# EAGLE schematic Main&MotorBoard v15 (EAGLE 9.7.0)
Assembly variants: supply, A

## Sheet 1 of 7: Cover
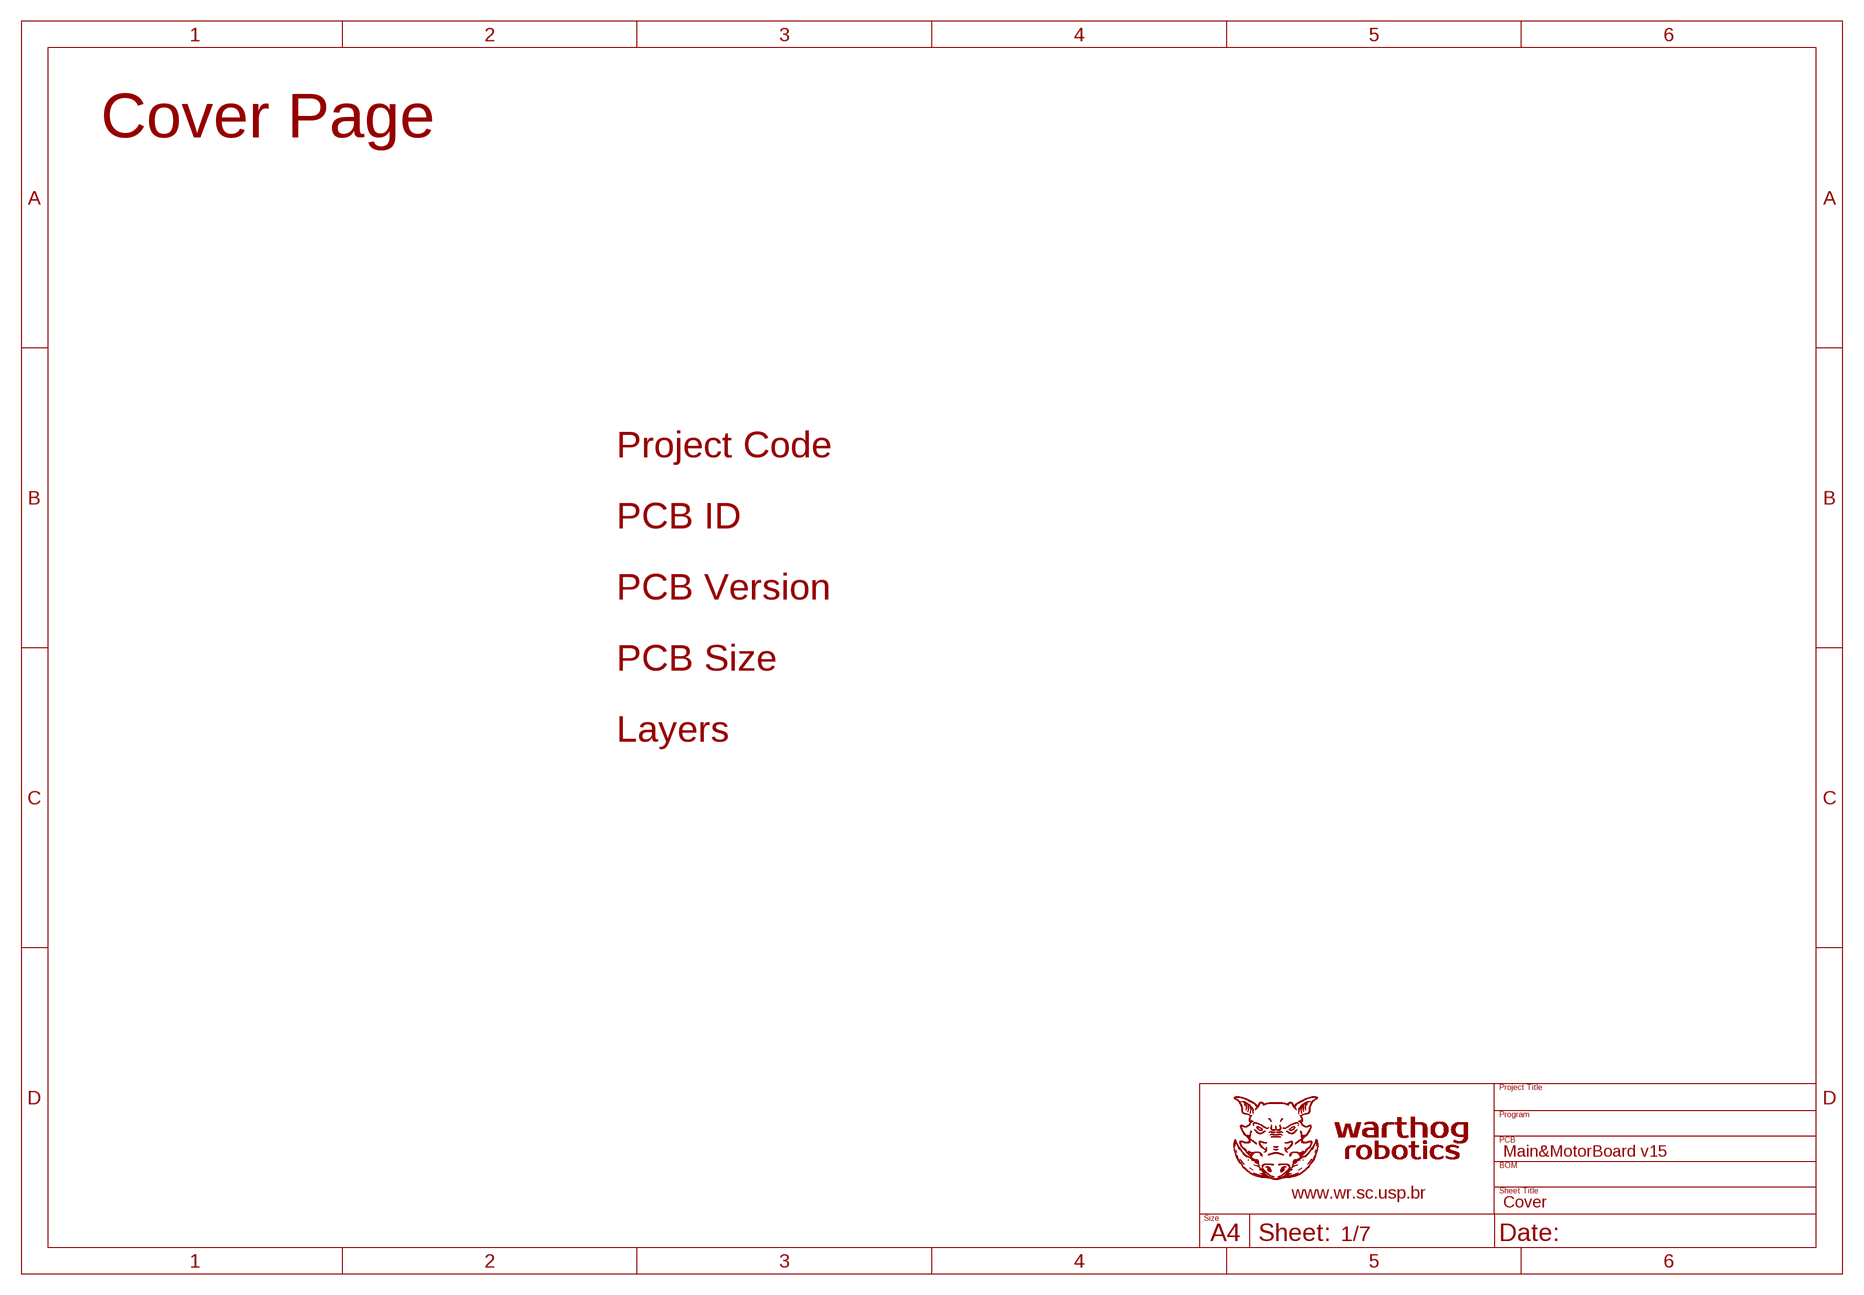
[diagram p0: schematic, sheet 1]

## Sheet 2 of 7: SUPPLY
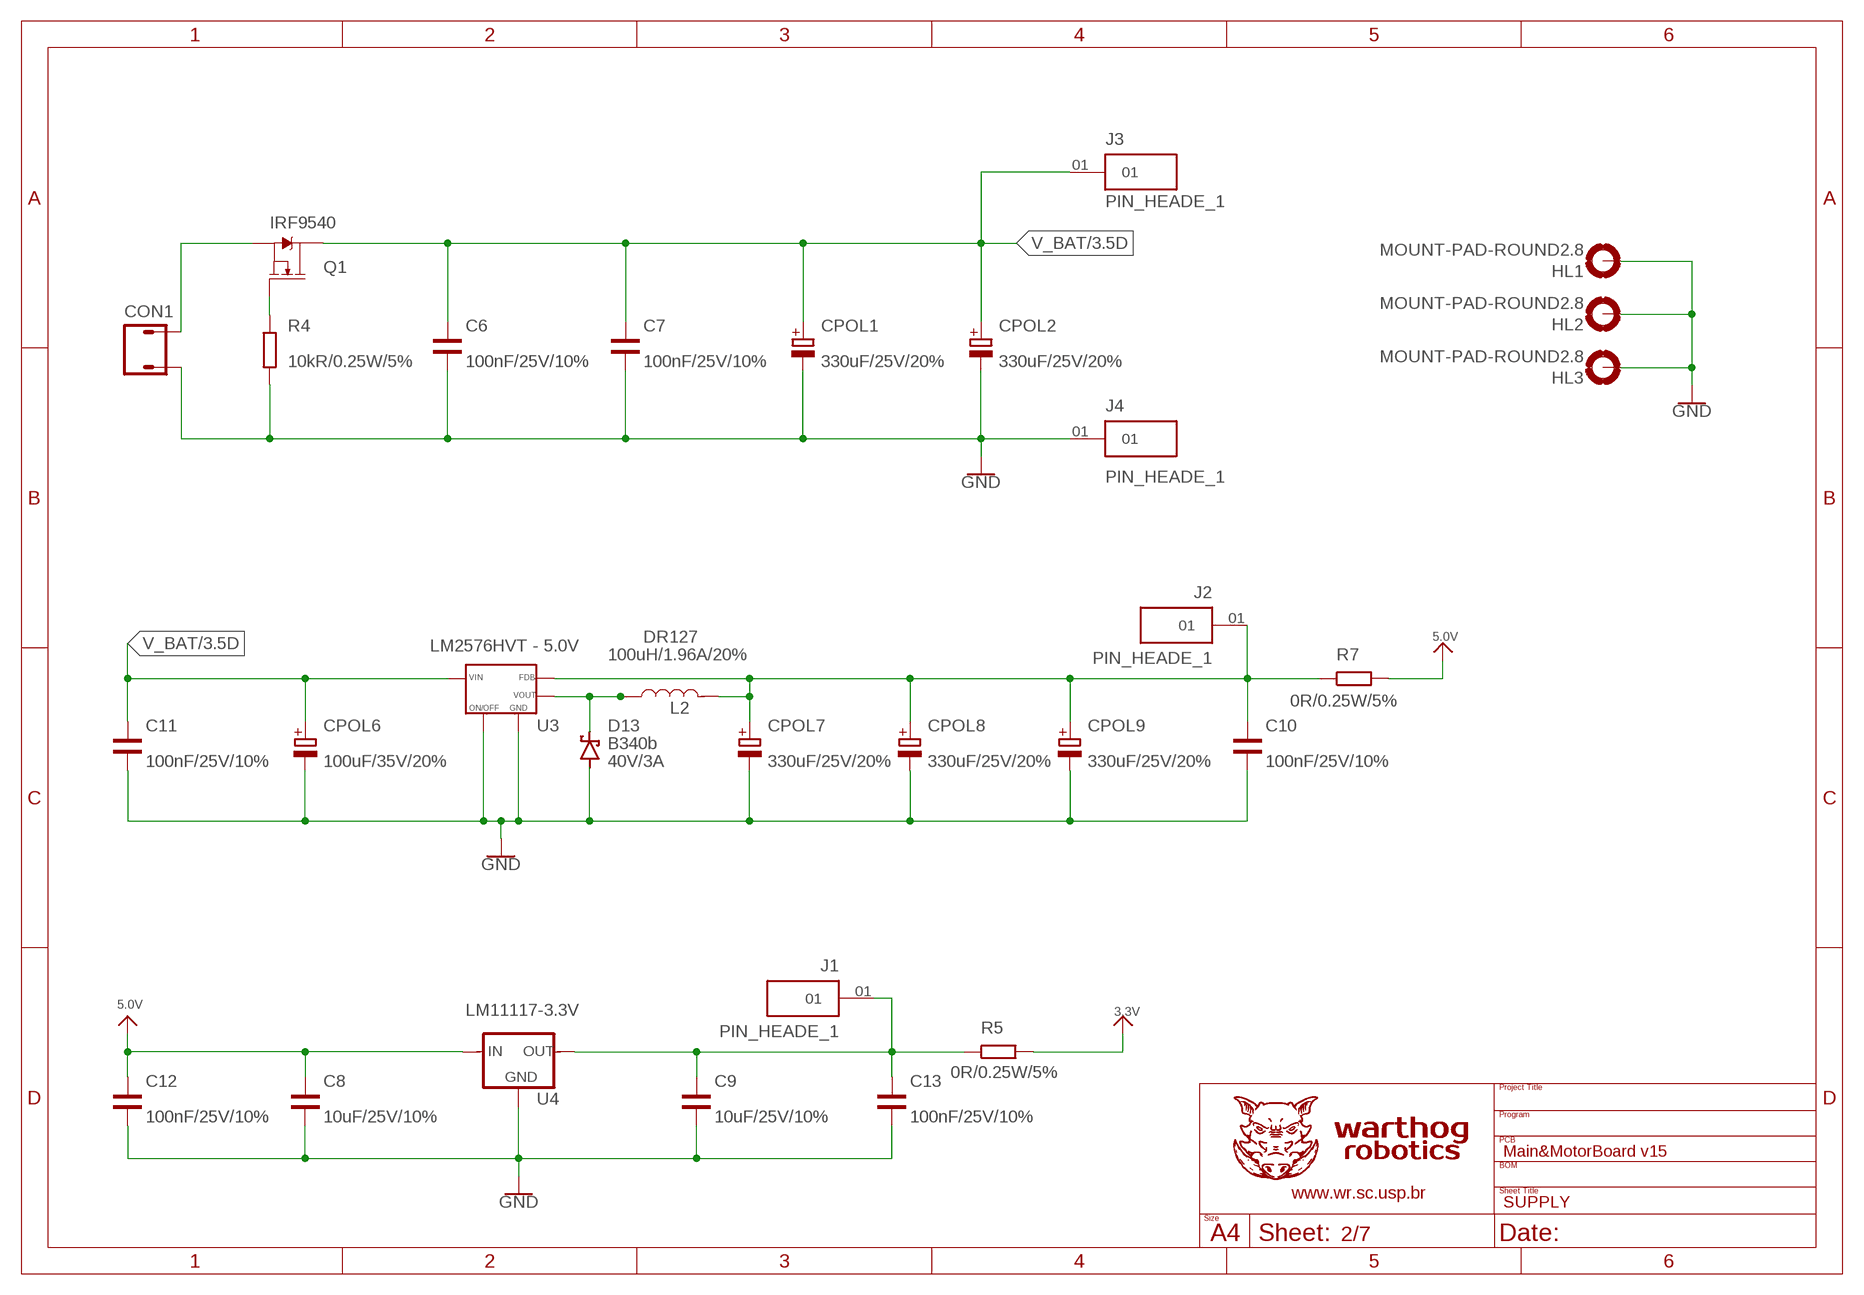
[diagram p1: schematic, sheet 2]

### Parts
C6  100nF/25V/10%  C0805(M)  [C0805(M)]
C7  100nF/25V/10%  C0805(M)  [C0805(M)]
C8  10uF/25V/10%  C0805(M)  [C0805(M)]
C9  10uF/25V/10%  C0805(M)  [C0805(M)]
C10  100nF/25V/10%  C0805(M)  [C0805(M)]
C11  100nF/25V/10%  C0805(M)  [C0805(M)]
C12  100nF/25V/10%  C0805(M)  [C0805(M)]
C13  100nF/25V/10%  C0805(M)  [C0805(M)]
CON1  MICROFIT_HEADER-2X01-90°-BACKUP  [2X01-3.00MM-90°]
CPOL1  330uF/25V/20%  CPOLE5-10.5  [E5-10,5]
CPOL2  330uF/25V/20%  CPOLE5-10.5  [E5-10,5]
CPOL6  100uF/35V/20%  CPOLE5-10.5  [E5-10,5]
CPOL7  330uF/25V/20%  CPOLE5-10.5  [E5-10,5]
CPOL8  330uF/25V/20%  CPOLE5-10.5  [E5-10,5]
CPOL9  330uF/25V/20%  CPOLE5-10.5  [E5-10,5]
D13  40V/3A  DIODE_SCHOTTIK  [SMC]
HL1  MOUNT-PAD-ROUND2.8  [2,8-PAD]
HL2  MOUNT-PAD-ROUND2.8  [2,8-PAD]
HL3  MOUNT-PAD-ROUND2.8  [2,8-PAD]
J1  PIN_HEADE_1  [SAMTEC_MTMM-101-X-X-S-X]
J2  PIN_HEADE_1  [SAMTEC_MTMM-101-X-X-S-X]
J3  PIN_HEADE_1  [SAMTEC_MTMM-101-X-X-S-X]
J4  PIN_HEADE_1  [SAMTEC_MTMM-101-X-X-S-X]
L2  100uH/1.96A/20%  INDUCTOR  [DR127]
Q1  IRF9540  [TO254P1052X465X1989-3]
R4  10kR/0.25W/5%  R0805(M)  [C0805(M)]  (not fitted in variant supply)
R5  0R/0.25W/5%  R0805(M)  [C0805(M)]
R7  0R/0.25W/5%  R0805(M)  [C0805(M)]
U3  LM2576HVT - 5.0V  LM2576  [TO263-5]
U4  LM11117-3.3V  REG1117  [SOT230P700X170-4]

### Nets
3.3V [Power]: R5.2 ; also sheet 4,5,6,7
5.0V [Power]: C8.1 C12.1 R7.2 U4.3(IN) ; also sheet 3,4
FDB: C10.1 CPOL7.+ CPOL8.+ CPOL9.+ J2.01 L2.1 R7.1 U3.FDB(FEEDBACK)
GND [Power]: C6.2 C7.2 C8.2 C9.2 C10.2 C11.2 C12.2 C13.2 CON1.2 CPOL1.- CPOL2.- CPOL6.- CPOL7.- CPOL8.- CPOL9.- D13.A HL1.B2,8(MOUNT) HL2.B2,8(MOUNT) HL3.B2,8(MOUNT) J4.01 R4.2 U3.GND U3.ON/OFF(ON\OFF) U3.TAB(GND) U4.1(GND) ; also sheet 3,4,5,6,7
N$5: CON1.1 Q1.S
N$7: Q1.G R4.1
N$11 [Power]: D13.C L2.2 U3.OUT
OUT_3.3: C9.1 C13.1 J1.01 R5.1 U4.2(OUT) U4.4(OUT)
V_BAT: C6.1 C7.1 C11.1 CPOL1.+ CPOL2.+ CPOL6.+ J3.01 Q1.D U3.VIN ; also sheet 3,4

### Notes on the sheet
- DR127
- B340b

## Sheet 3 of 7: MOTOR DRIVE
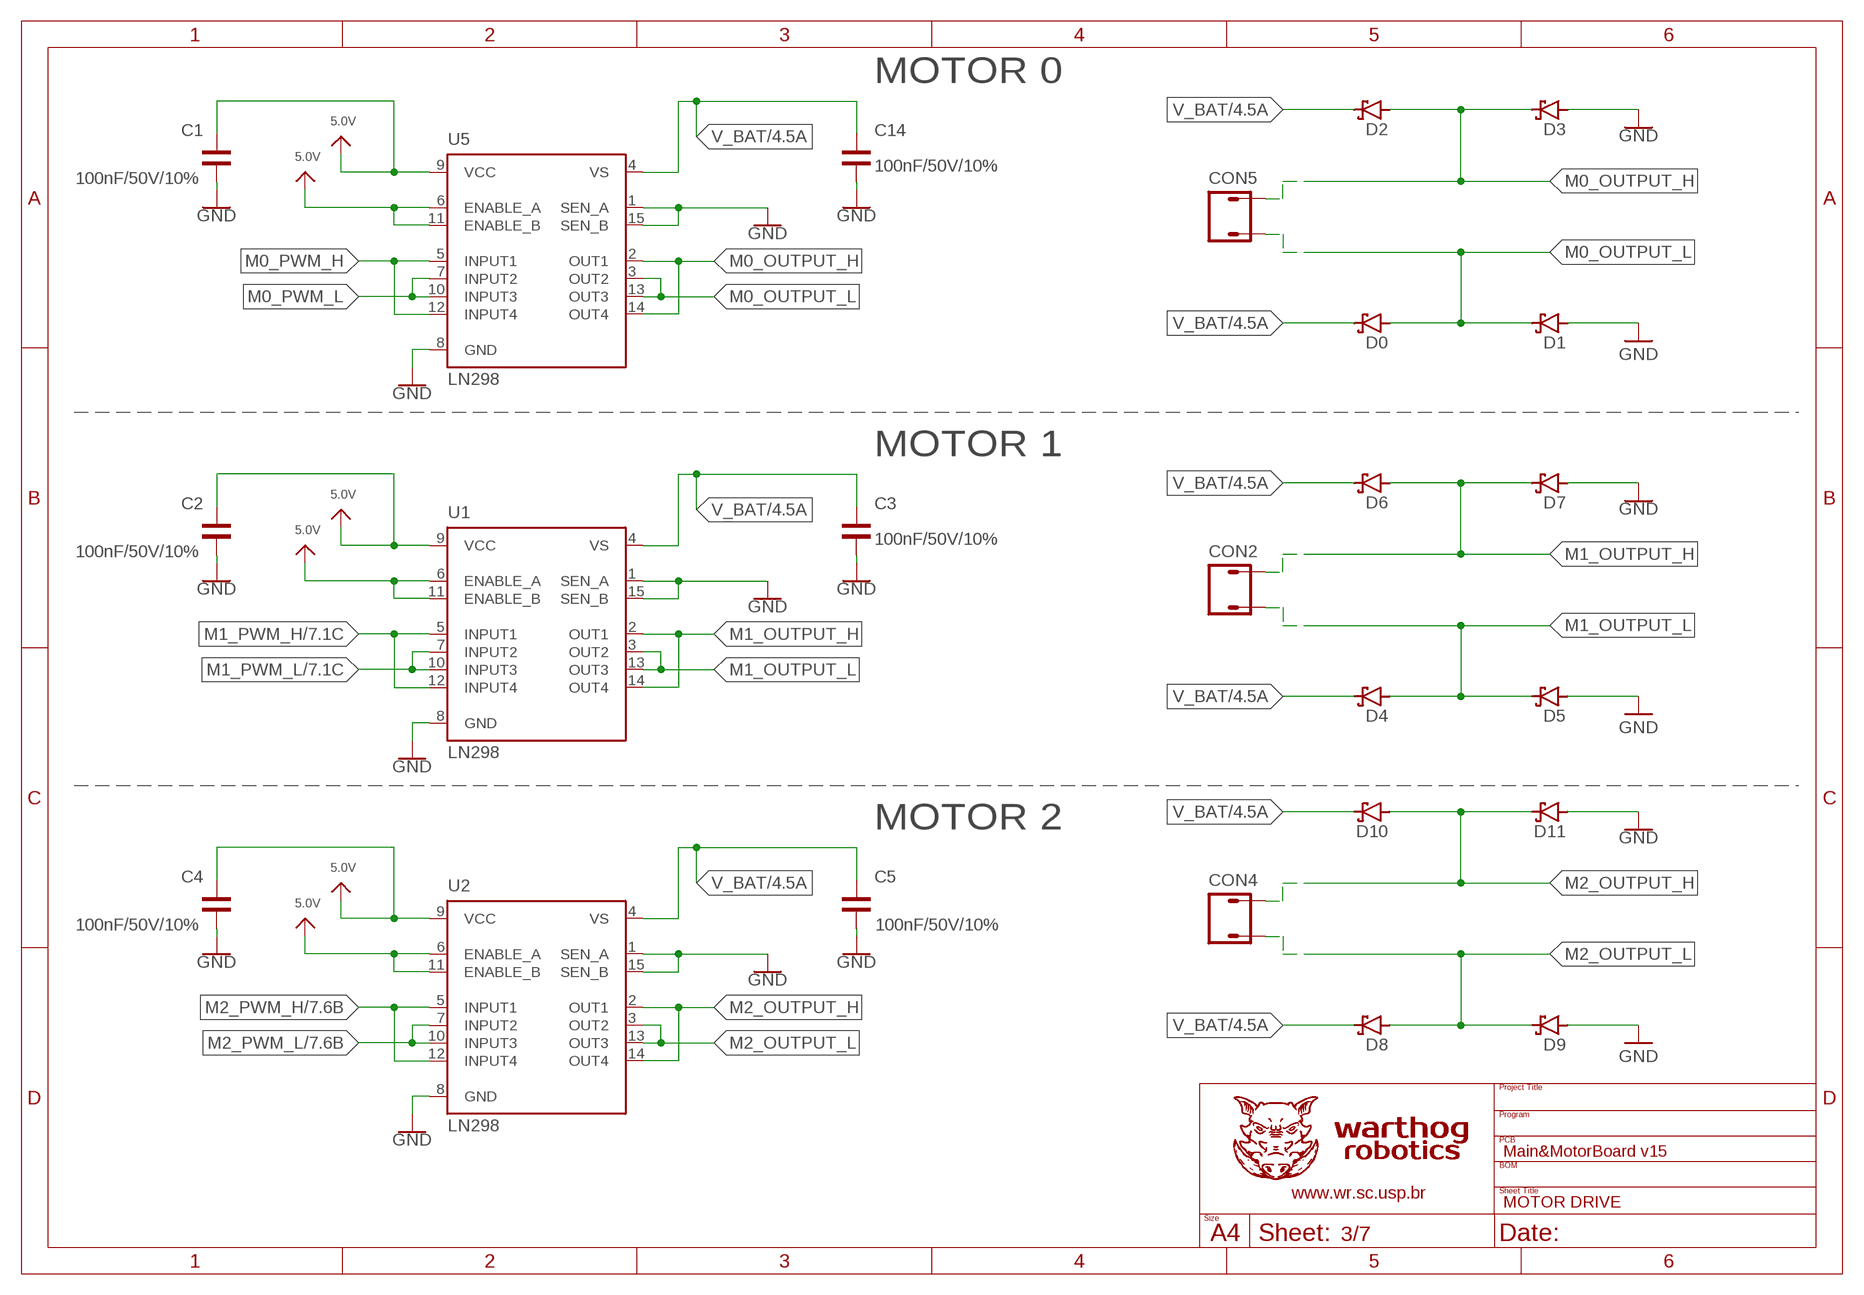
[diagram p2: schematic, sheet 3]

### Parts
C1  100nF/50V/10%  C0805(N)  [C0805(N)]
C2  100nF/50V/10%  C0805(N)  [C0805(N)]
C3  100nF/50V/10%  C0805(N)  [C0805(N)]
C4  100nF/50V/10%  C0805(N)  [C0805(N)]
C5  100nF/50V/10%  C0805(N)  [C0805(N)]
C14  100nF/50V/10%  C0805(N)  [C0805(N)]
CON2  MICROFIT_HEADER-2X01-90°-BACKUP  [2X01-3.00MM-90°]
CON4  MICROFIT_HEADER-2X01-90°-BACKUP  [2X01-3.00MM-90°]
CON5  MICROFIT_HEADER-2X01-90°-BACKUP  [2X01-3.00MM-90°]
D0  1N5406  [DO201-15(N)]
D1  1N5406  [DO201-15(N)]
D2  1N5406  [DO201-15(N)]
D3  1N5406  [DO201-15(N)]
D4  1N5406  [DO201-15(N)]
D5  1N5406  [DO201-15(N)]
D6  1N5406  [DO201-15(N)]
D7  1N5406  [DO201-15(N)]
D8  1N5406  [DO201-15(N)]
D9  1N5406  [DO201-15(N)]
D10  1N5406  [DO201-15(N)]
D11  1N5406  [DO201-15(N)]
U1  LN298  L298  [MULTIWATT-15]  (not fitted in variant supply)
U2  LN298  L298  [MULTIWATT-15]  (not fitted in variant supply)
U5  LN298  L298  [MULTIWATT-15]  (not fitted in variant supply)

### Nets
5.0V [Power]: C1.1 C2.1 C4.1 U1.6(ENABLE_A) U1.9(VCC) U1.11(ENABLE_B) U2.6(ENABLE_A) U2.9(VCC) U2.11(ENABLE_B) U5.6(ENABLE_A) U5.9(VCC) U5.11(ENABLE_B) ; also sheet 2,4
GND [Power]: C1.2 C2.2 C3.2 C4.2 C5.2 C14.2 D1.A D3.A D5.A D7.A D9.A D11.A U1.1(SEN_A) U1.8(GND) U1.15(SEN_B) U2.1(SEN_A) U2.8(GND) U2.15(SEN_B) U5.1(SEN_A) U5.8(GND) U5.15(SEN_B) ; also sheet 2,4,5,6,7
M0_OUTPUT_H: CON5.1 D2.A D3.C U5.2(OUT1) U5.14(OUT4)
M0_OUTPUT_L: CON5.2 D0.A D1.C U5.3(OUT2) U5.13(OUT3)
M0_PWM_H: U5.5(INPUT1) U5.12(INPUT4)
M0_PWM_L: U5.7(INPUT2) U5.10(INPUT3)
M1_OUTPUT_H: CON2.1 D6.A D7.C U1.2(OUT1) U1.14(OUT4)
M1_OUTPUT_L: CON2.2 D4.A D5.C U1.3(OUT2) U1.13(OUT3)
M1_PWM_H: U1.5(INPUT1) U1.12(INPUT4) ; also sheet 7
M1_PWM_L: U1.7(INPUT2) U1.10(INPUT3) ; also sheet 7
M2_OUTPUT_H: CON4.1 D10.A D11.C U2.2(OUT1) U2.14(OUT4)
M2_OUTPUT_L: CON4.2 D8.A D9.C U2.3(OUT2) U2.13(OUT3)
M2_PWM_H: U2.5(INPUT1) U2.12(INPUT4) ; also sheet 7
M2_PWM_L: U2.7(INPUT2) U2.10(INPUT3) ; also sheet 7
V_BAT: C3.1 C5.1 C14.1 D0.C D2.C D4.C D6.C D8.C D10.C U1.4(VS) U2.4(VS) U5.4(VS) ; also sheet 2,4

### Notes on the sheet
- MOTOR 0
- MOTOR 1
- MOTOR 2

## Sheet 4 of 7: COMMUNICATION
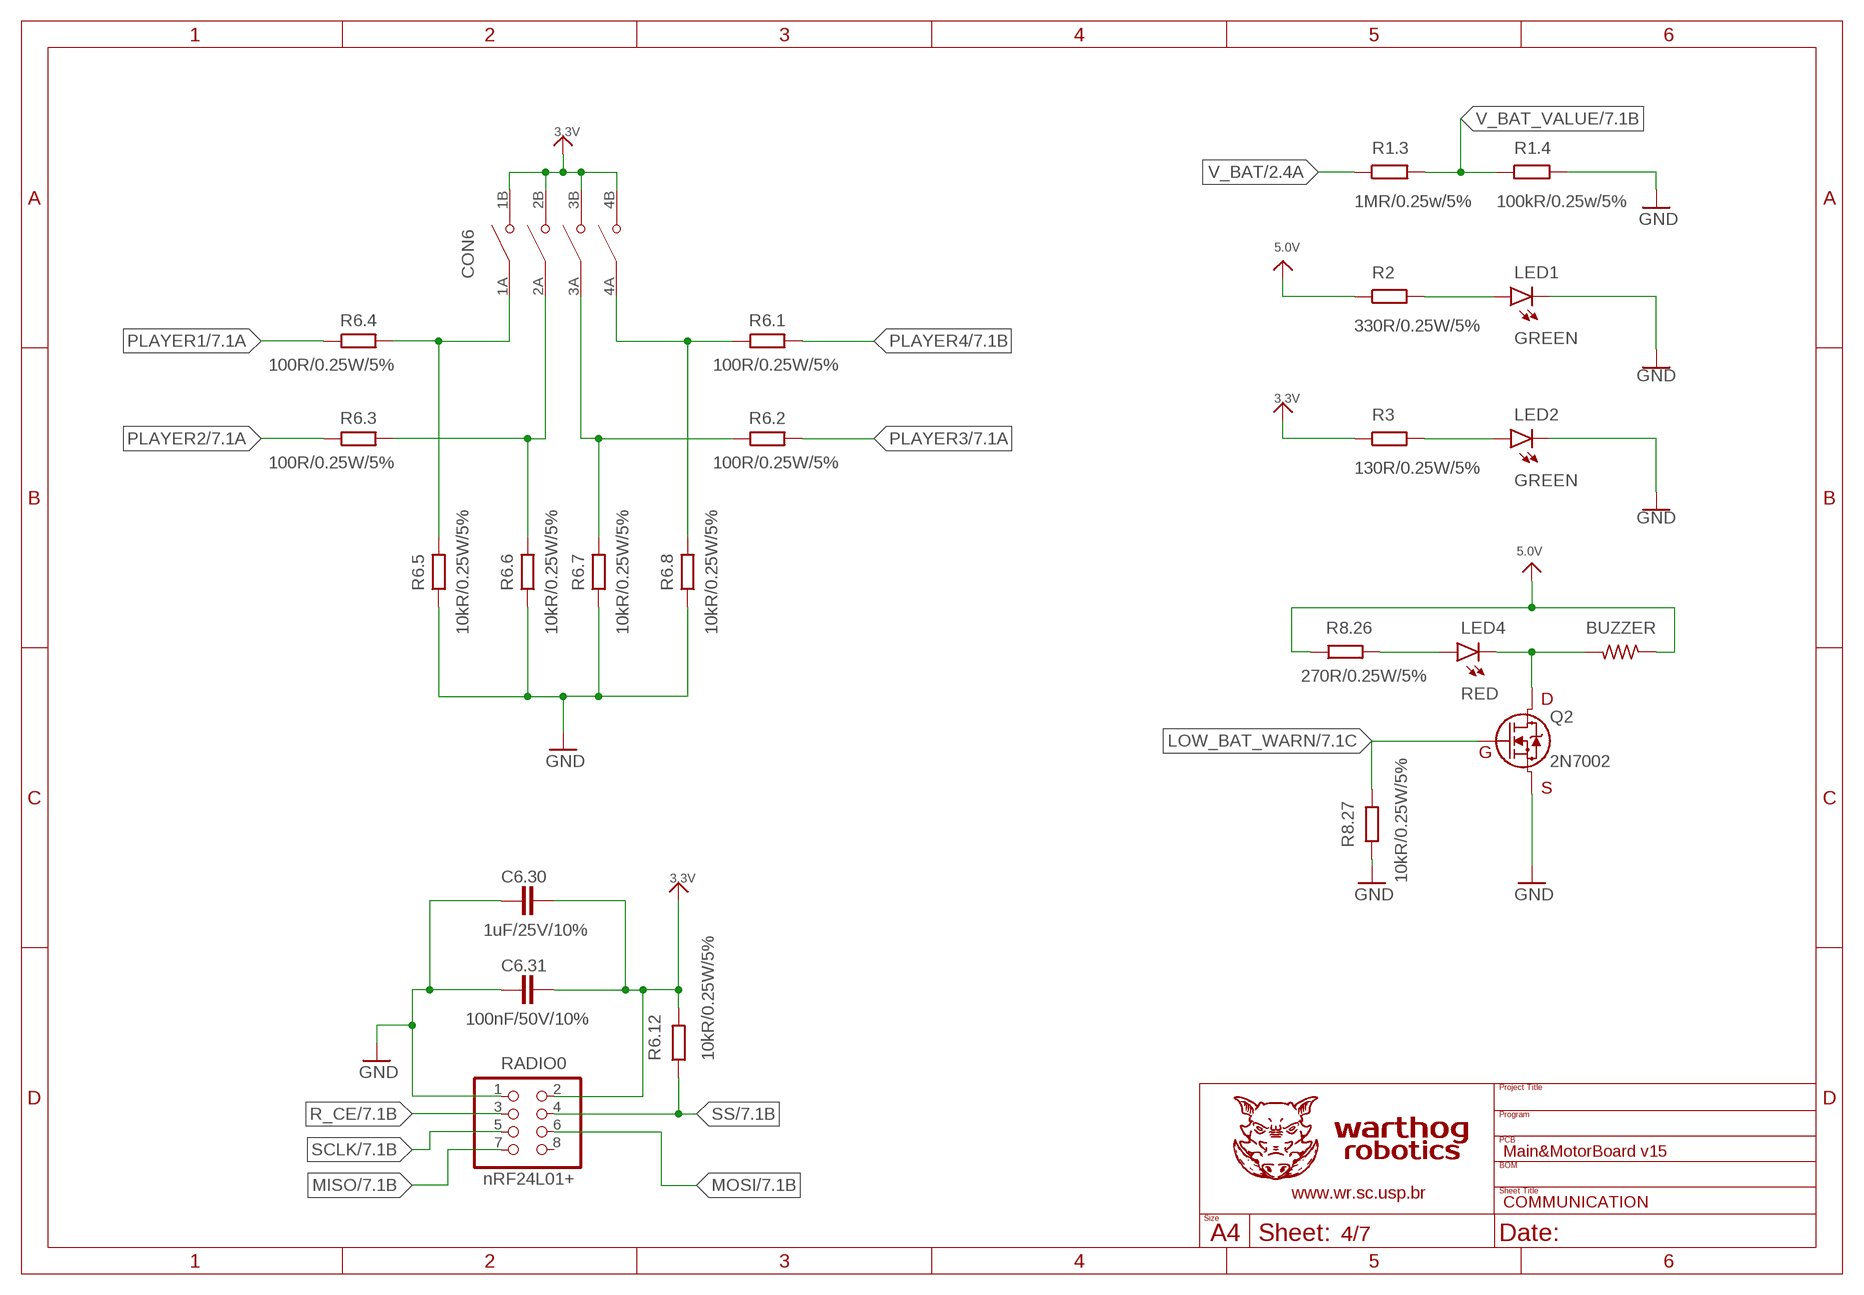
[diagram p3: schematic, sheet 4]

### Parts
BUZZER  R-US_0204/7  [0204/7]
C6.30  1uF/25V/10%  C-EUC0805  [C0805]
C6.31  100nF/50V/10%  C-EUC0805  [C0805]
CON6  DS01C-254-L-04BE  [SW_DS01C-254-L-04BE]
LED1  GREEN  LEDSML0402  [SML0402]
LED2  GREEN  LEDSML0402  [SML0402]
LED4  RED  LEDSML0402  [SML0402]
Q2  2N7002  2N7002,215TO-236AB_NEX-M  [TO-236AB_NEX-M]
R1.3  1MR/0.25w/5%  R-EU_R0805  [R0805]
R1.4  100kR/0.25w/5%  R-EU_R0805  [R0805]
R2  330R/0.25W/5%  RC0603(M)  [C0603(M)]
R3  130R/0.25W/5%  RC0603(M)  [C0603(M)]
R6.1  100R/0.25W/5%  R0805(M)  [C0805(M)]
R6.2  100R/0.25W/5%  R0805(M)  [C0805(M)]
R6.3  100R/0.25W/5%  R0805(M)  [C0805(M)]
R6.4  100R/0.25W/5%  R0805(M)  [C0805(M)]
R6.5  10kR/0.25W/5%  R0805(M)  [C0805(M)]
R6.6  10kR/0.25W/5%  R0805(M)  [C0805(M)]
R6.7  10kR/0.25W/5%  R0805(M)  [C0805(M)]
R6.8  10kR/0.25W/5%  R0805(M)  [C0805(M)]
R6.12  10kR/0.25W/5%  R0805(M)  [C0805(M)]
R8.26  270R/0.25W/5%  R0805(M)  [C0805(M)]
R8.27  10kR/0.25W/5%  R0805(M)  [C0805(M)]
RADIO0  nRF24L01+  PINHD-2X4  [2X04]

### Nets
3.3V [Power]: C6.30.2 C6.31.2 CON6.1B(NO1) CON6.2B(NO2) CON6.3B(NO3) CON6.4B(NO4) R3.1 R6.12.2 RADIO0.2 ; also sheet 2,5,6,7
5.0V [Power]: BUZZER.1 R2.1 R8.26.1 ; also sheet 2,3
GND [Power]: C6.30.1 C6.31.1 LED1.1(C) LED2.1(C) Q2.2 R1.4.2 R6.5.1 R6.6.1 R6.7.1 R6.8.1 R8.27.1 RADIO0.1 ; also sheet 2,3,5,6,7
LOW_BAT_WARN: Q2.1 R8.27.2 ; also sheet 7
MISO: RADIO0.7 ; also sheet 7
MOSI: RADIO0.6 ; also sheet 7
N$2: LED1.2(A) R2.2
N$3: LED2.2(A) R3.2
N$8 [Power]: BUZZER.2 LED4.1(C) Q2.3
N$9: LED4.2(A) R8.26.2
N$31 [Power]: CON6.1A(COM1) R6.4.2 R6.5.2
N$35 [Power]: CON6.2A(COM2) R6.3.2 R6.6.2
N$37 [Power]: CON6.3A(COM3) R6.2.1 R6.7.2
N$58 [Power]: CON6.4A(COM4) R6.1.1 R6.8.2
PLAYER1: R6.4.1 ; also sheet 7
PLAYER2: R6.3.1 ; also sheet 7
PLAYER3: R6.2.2 ; also sheet 7
PLAYER4: R6.1.2 ; also sheet 7
R_CE: RADIO0.3 ; also sheet 7
SCLK: RADIO0.5 ; also sheet 7
SS: R6.12.1 RADIO0.4 ; also sheet 7
V_BAT: R1.3.1 ; also sheet 2,3
V_BAT_VALUE: R1.3.2 R1.4.1 ; also sheet 7
Unconnected: RADIO0.8

## Sheet 5 of 7: SENSORS_AND_BUTTOMS
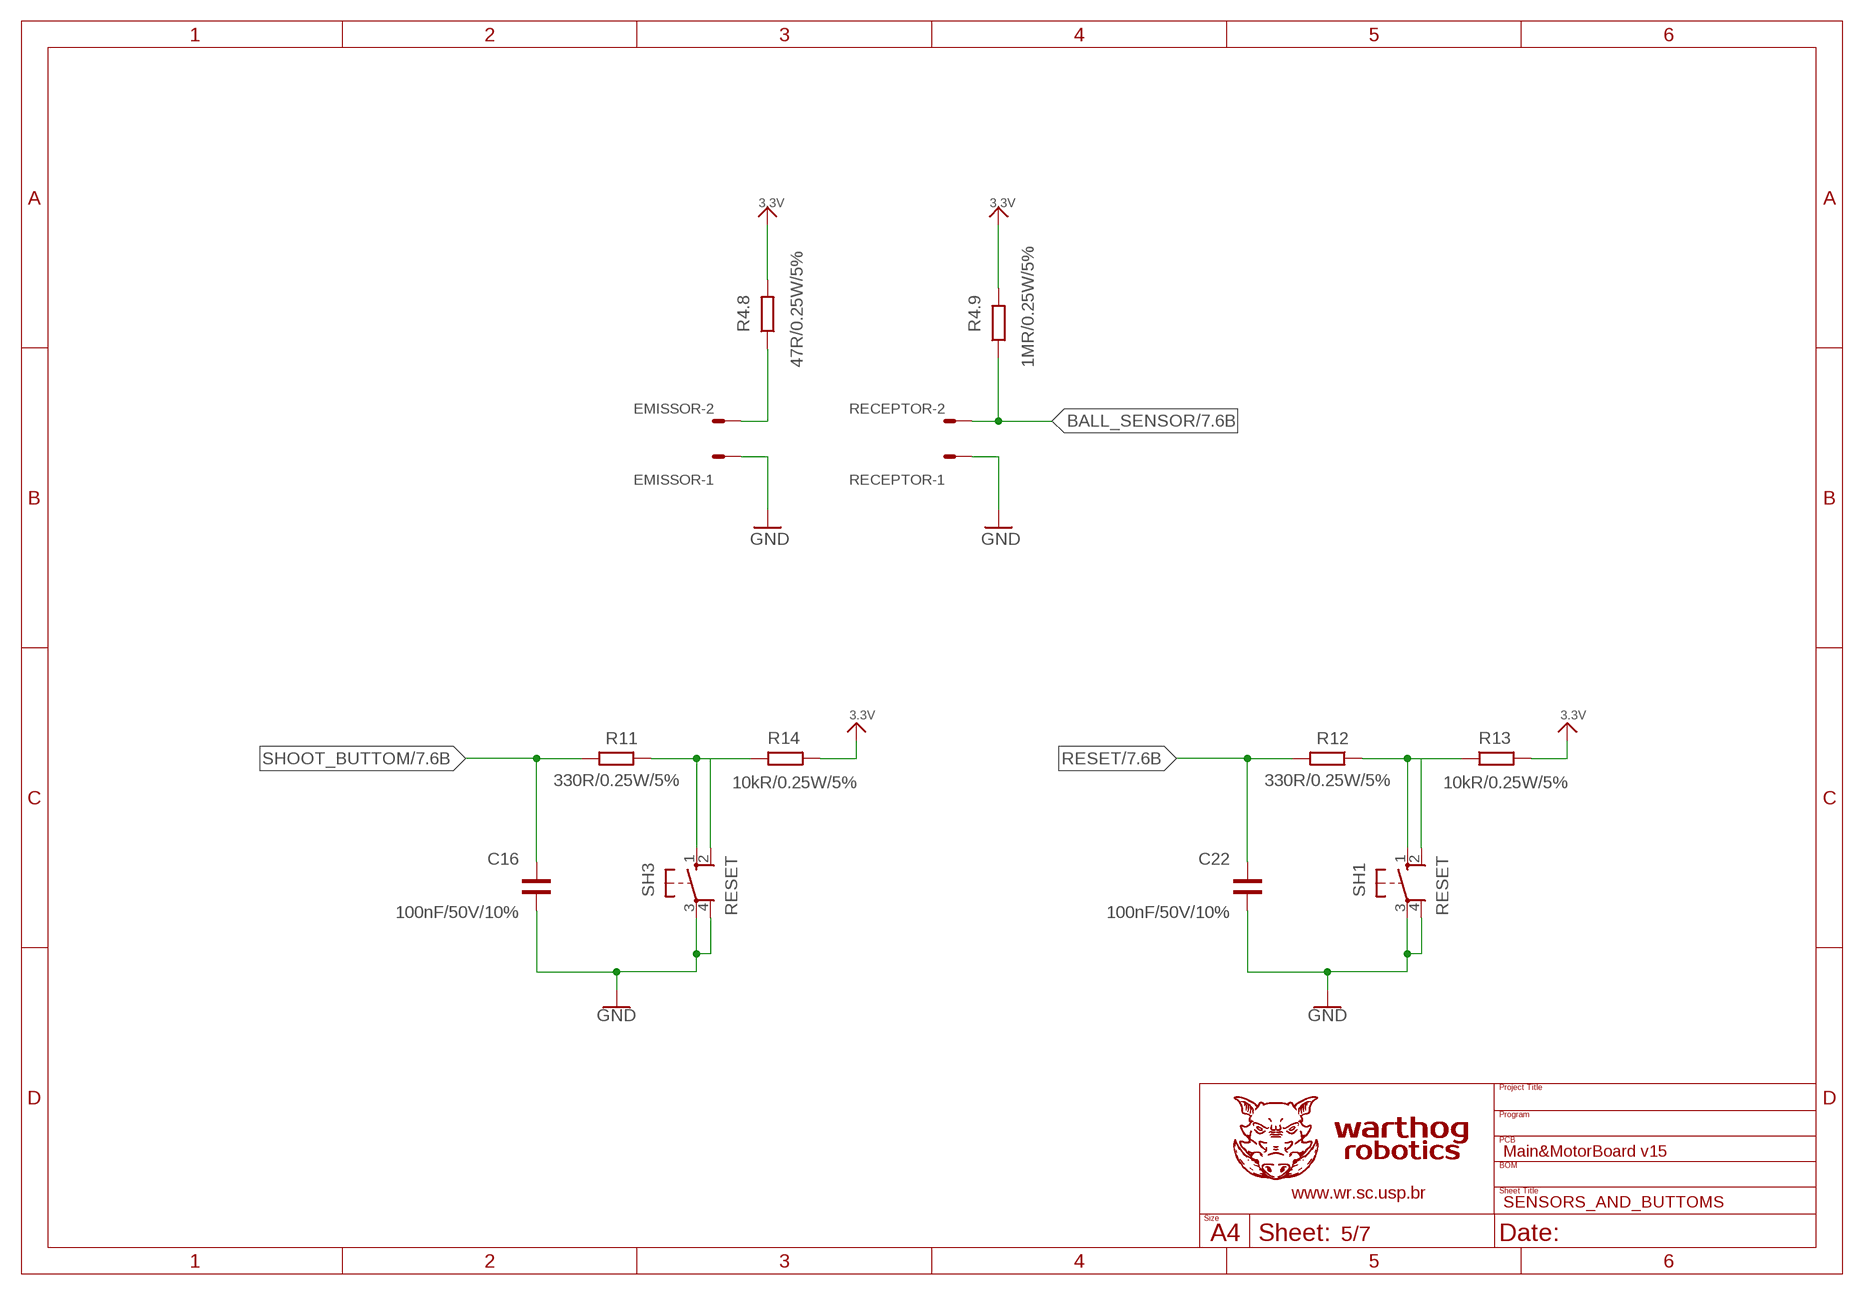
[diagram p4: schematic, sheet 5]

### Parts
C16  100nF/50V/10%  C0805(M)  [C0805(M)]
C22  100nF/50V/10%  C0805(M)  [C0805(M)]
EMISSOR  22-05-7028-02  [7395-02]
R4.8  47R/0.25W/5%  R0805(M)  [C0805(M)]
R4.9  1MR/0.25W/5%  R0805(M)  [C0805(M)]
R11  330R/0.25W/5%  RC1206(N)  [C1206(N)]
R12  330R/0.25W/5%  RC1206(N)  [C1206(N)]
R13  10kR/0.25W/5%  RC1206(N)  [C1206(N)]
R14  10kR/0.25W/5%  RC1206(N)  [C1206(N)]
RECEPTOR  22-05-7028-02  [7395-02]
SH1  RESET  PUSH_BUTTOM  [B3F-10XX]
SH3  RESET  PUSH_BUTTOM  [B3F-10XX]

### Nets
3.3V [Power]: R4.8.2 R4.9.2 R13.2 R14.2 ; also sheet 2,4,6,7
BALL_SENSOR: R4.9.1 RECEPTOR.2 ; also sheet 7
GND [Power]: C16.2 C22.2 EMISSOR.1 RECEPTOR.1 SH1.3(P) SH1.4(P1) SH3.3(P) SH3.4(P1) ; also sheet 2,3,4,6,7
N$1: SH1.2(S1)
N$6 [Power]: EMISSOR.2 R4.8.1
N$16: R12.1 R13.1 SH1.1(S)
N$21: R11.1 R14.1 SH3.1(S)
N$22: SH3.2(S1)
RESET: C22.1 R12.2 ; also sheet 7
SHOOT_BUTTOM: C16.1 R11.2 ; also sheet 7

## Sheet 6 of 7: KICK'S_CONNECTION
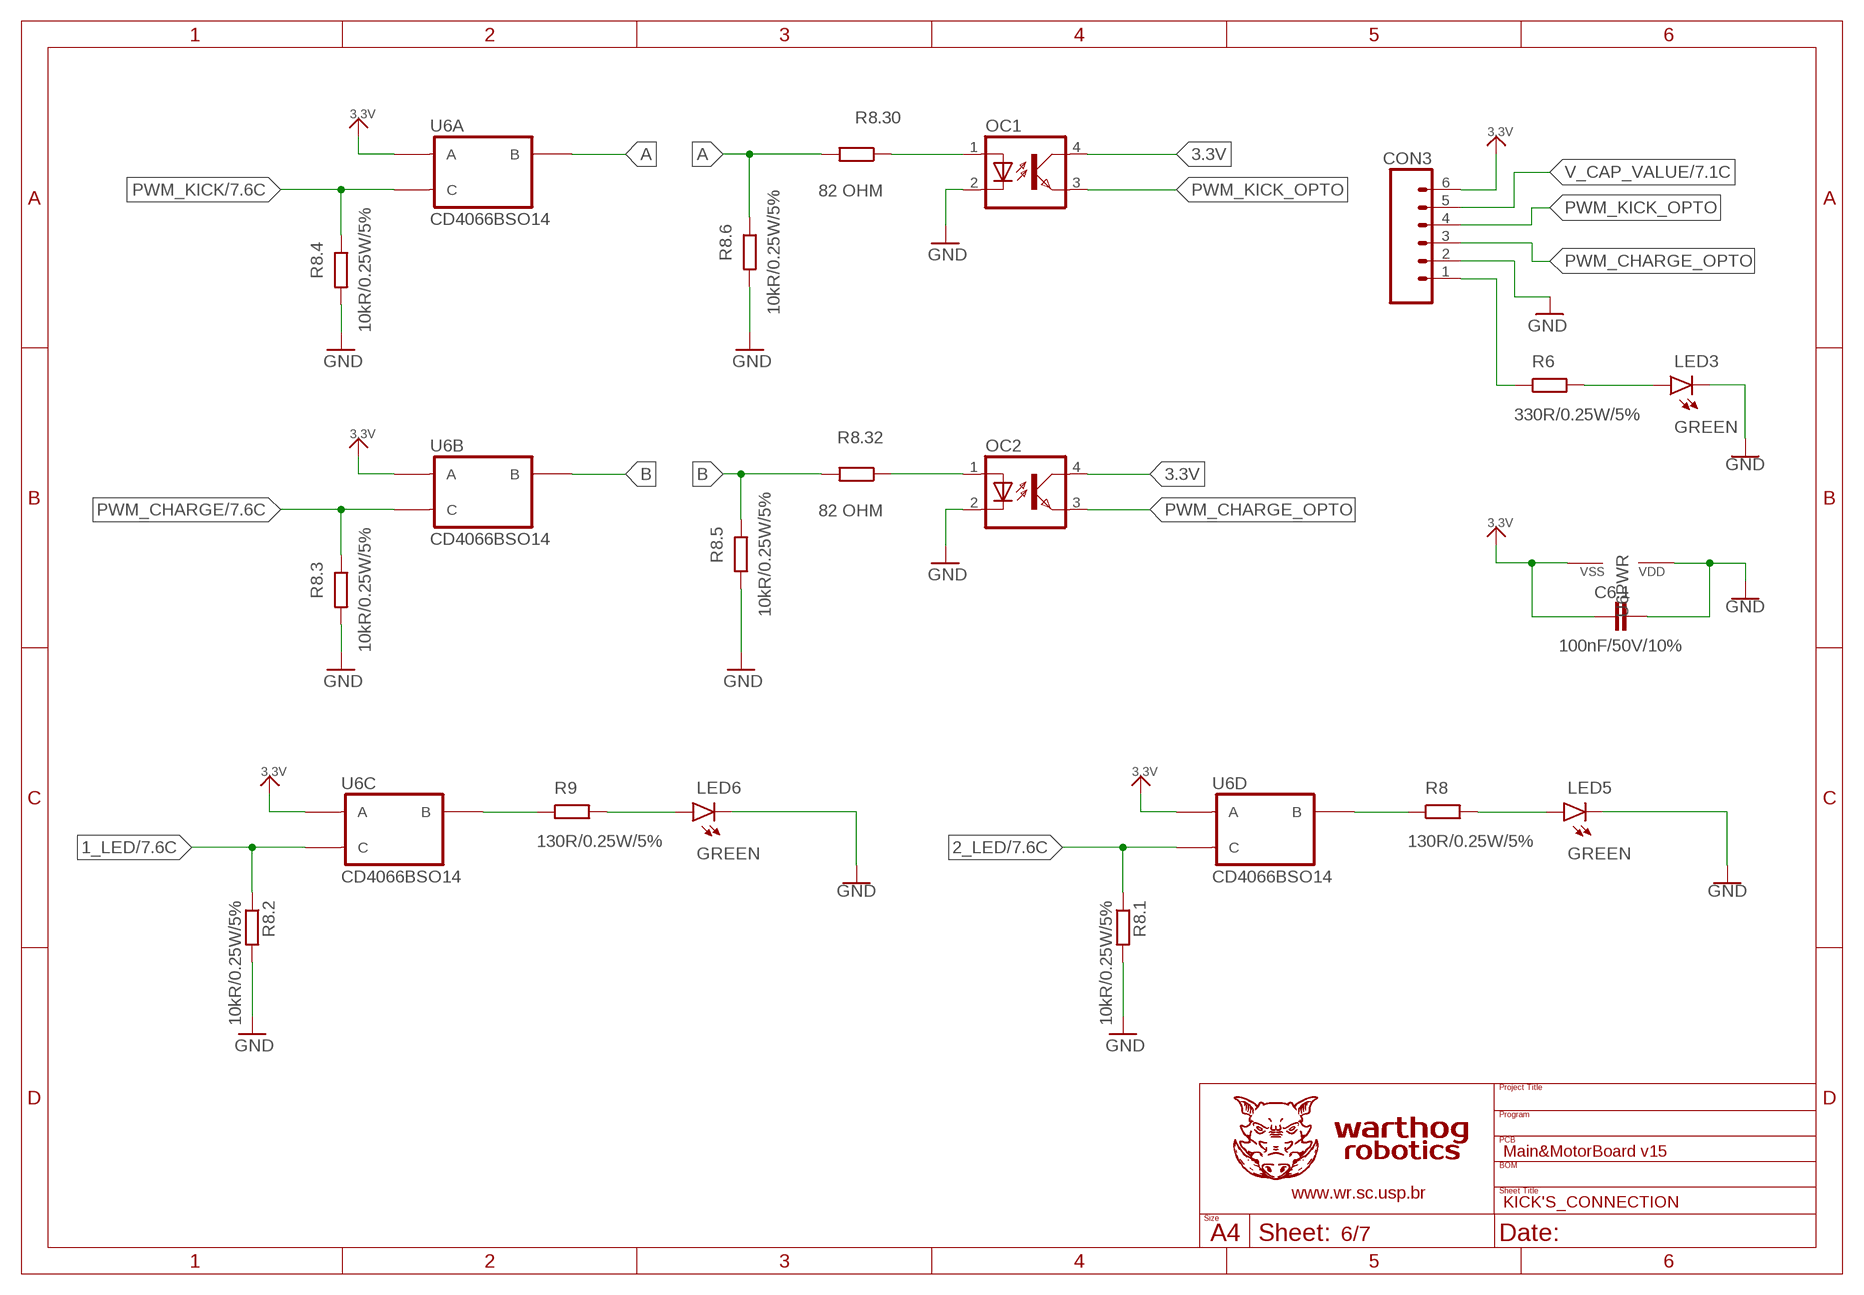
[diagram p5: schematic, sheet 6]

### Parts
C6.1  100nF/50V/10%  C-EUC0805  [C0805]
CON3  PIN_HEADER_MALE-1X06  [1X06-2.54MM]
LED3  GREEN  LEDSML0402  [SML0402]
LED5  GREEN  LEDSML0402  [SML0402]
LED6  GREEN  LEDSML0402  [SML0402]
OC1  PC817  [DIL04]
OC2  PC817  [DIL04]
R6  330R/0.25W/5%  R0805(M)  [C0805(M)]
R8  130R/0.25W/5%  RC0603(M)  [C0603(M)]
R8.1  10kR/0.25W/5%  R0805(M)  [C0805(M)]
R8.2  10kR/0.25W/5%  R0805(M)  [C0805(M)]
R8.3  10kR/0.25W/5%  R0805(M)  [C0805(M)]
R8.4  10kR/0.25W/5%  R0805(M)  [C0805(M)]
R8.5  10kR/0.25W/5%  R0805(M)  [C0805(M)]
R8.6  10kR/0.25W/5%  R0805(M)  [C0805(M)]
R8.30  82 OHM  R0805(M)  [C0805(M)]
R8.32  82 OHM  R0805(M)  [C0805(M)]
R9  130R/0.25W/5%  RC0603(M)  [C0603(M)]
U6  CD4066BSO14  [SO14(M)]

### Nets
1_LED: R8.2.1 U6.6(C:C) ; also sheet 7
2_LED: R8.1.1 U6.12(D:C) ; also sheet 7
3.3V [Power]: C6.1.1 CON3.6 OC1.4(COL) OC2.4(COL) U6.1(A:A) U6.4(B:A) U6.7(PWR:VSS) U6.8(C:A) U6.11(D:A) ; also sheet 2,4,5,7
3.3V_LED: CON3.1 R6.1
A: R8.6.1 R8.30.2 U6.2(A:B)
B: R8.5.1 R8.32.2 U6.3(B:B)
GND [Power]: C6.1.2 CON3.2 LED3.1(C) LED5.1(C) LED6.1(C) OC1.2(C) OC2.2(C) R8.1.2 R8.2.2 R8.3.2 R8.4.2 R8.5.2 R8.6.2 U6.14(PWR:VDD) ; also sheet 2,3,4,5,7
N$4: LED3.2(A) R6.2
N$10: OC1.1(A) R8.30.1
N$12: LED5.2(A) R8.2
N$13: LED6.2(A) R9.2
N$14: R8.1 U6.10(D:B)
N$15: R9.1 U6.9(C:B)
N$23: OC2.1(A) R8.32.1
PWM_CHARGE: R8.3.1 U6.5(B:C) ; also sheet 7
PWM_CHARGE_OPTO: CON3.3 OC2.3(EMIT)
PWM_KICK: R8.4.1 U6.13(A:C) ; also sheet 7
PWM_KICK_OPTO: CON3.4 OC1.3(EMIT)
V_CAP_VALUE: CON3.5 ; also sheet 7

## Sheet 7 of 7: MICROCONTROLLER
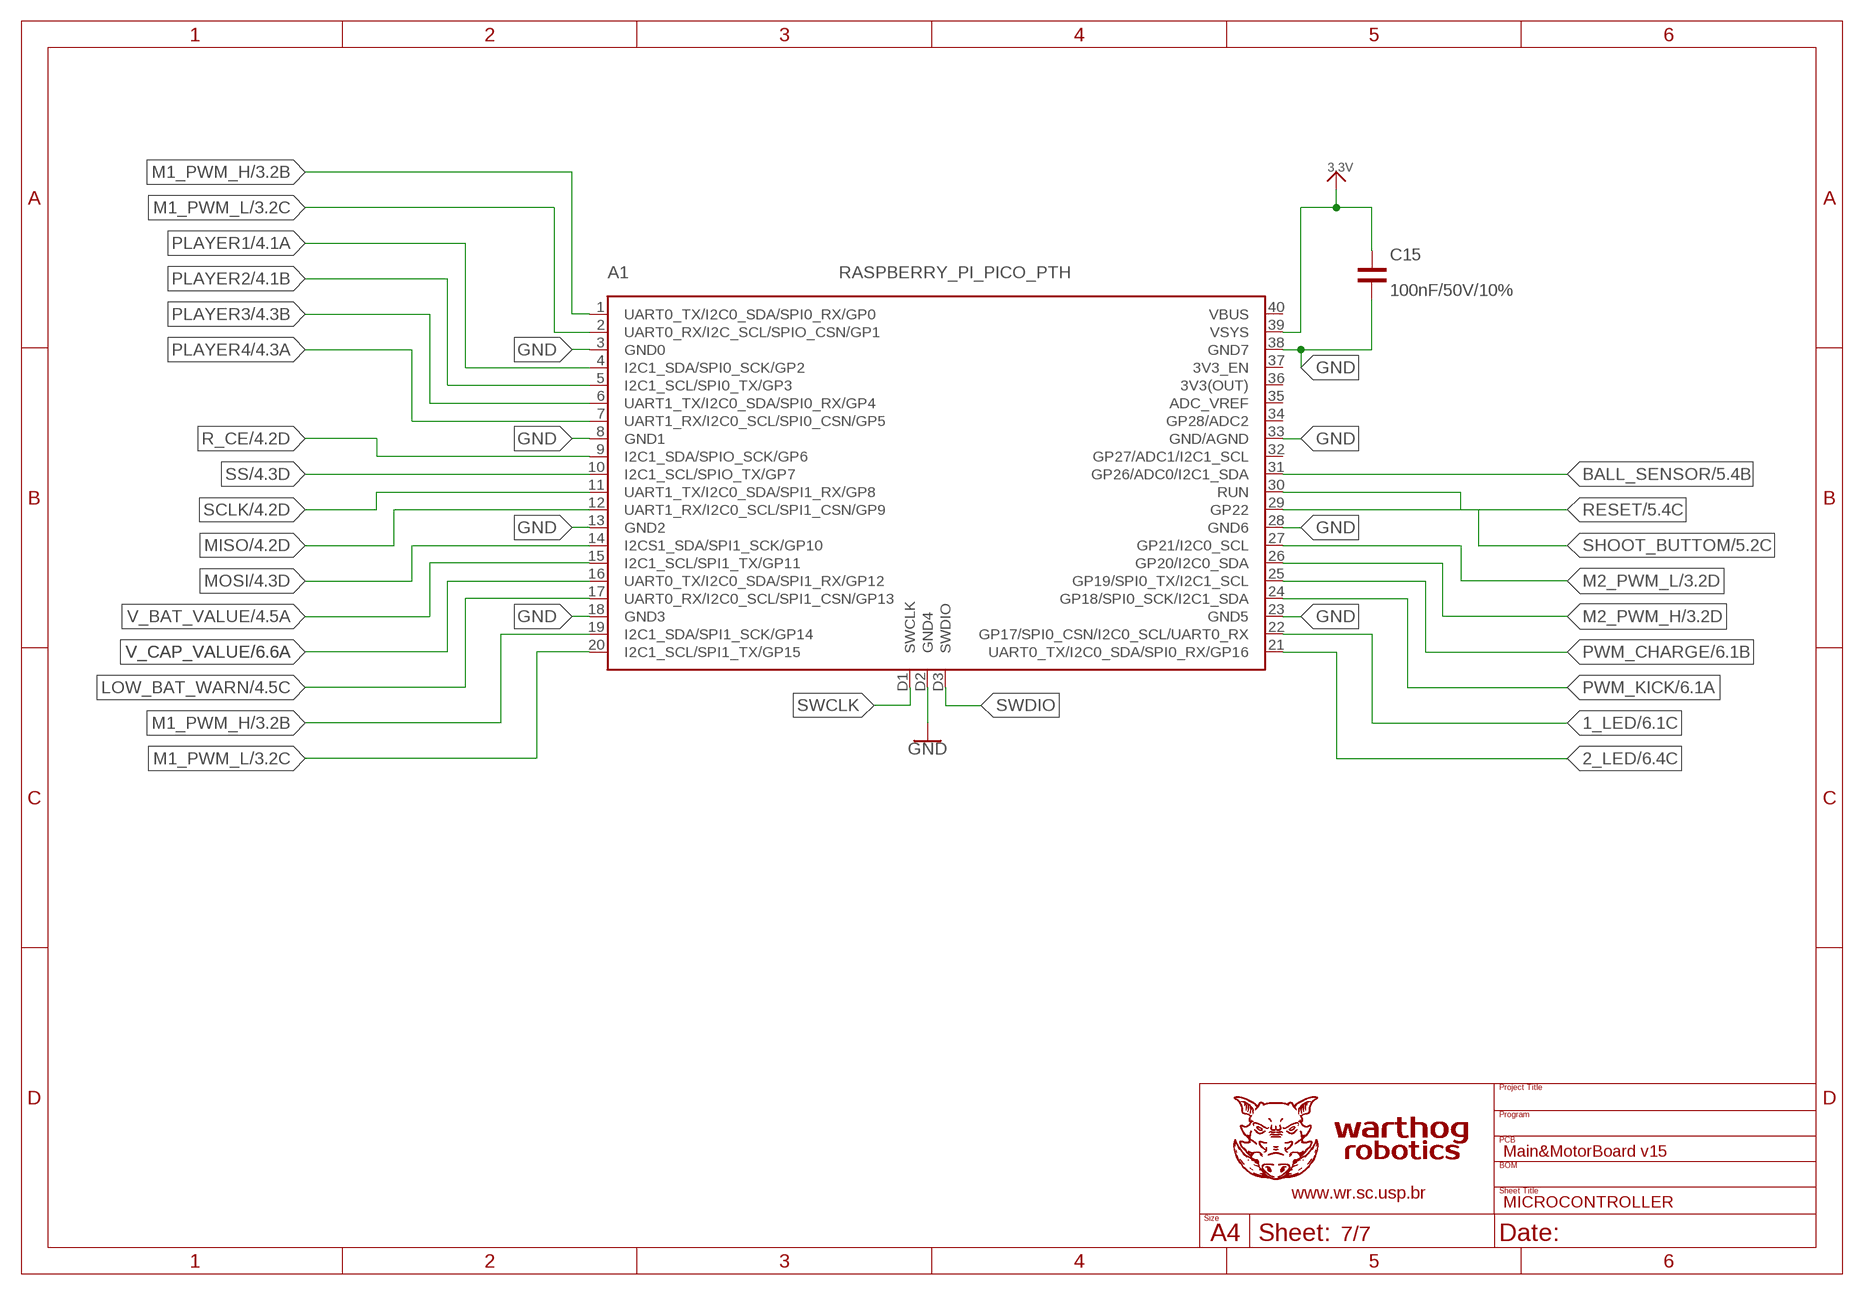
[diagram p6: schematic, sheet 7]

### Parts
A1  RASPBERRY_PI_PICO_PTH  [RASPBERRY_PI_PICO_PTH]
C15  100nF/50V/10%  C0805(M)  [C0805(M)]

### Nets
1_LED: A1.22(GP17/SPI0_CSN/I2C0_SCL/UART0_RX) ; also sheet 6
2_LED: A1.21(UART0_TX/I2C0_SDA/SPI0_RX/GP16) ; also sheet 6
3.3V [Power]: A1.39(VSYS) C15.1 ; also sheet 2,4,5,6
BALL_SENSOR: A1.31(GP26/ADC0/I2C1_SDA) ; also sheet 5
GND [Power]: A1.3(GND0) A1.8(GND1) A1.13(GND2) A1.18(GND3) A1.23(GND5) A1.28(GND6) A1.33(GND/AGND) A1.38(GND7) A1.D2(GND4) C15.2 ; also sheet 2,3,4,5,6
LOW_BAT_WARN: A1.17(UART0_RX/I2C0_SCL/SPI1_CSN/GP13) ; also sheet 4
M1_PWM_H: A1.1(UART0_TX/I2C0_SDA/SPI0_RX/GP0) A1.19(I2C1_SDA/SPI1_SCK/GP14) ; also sheet 3
M1_PWM_L: A1.2(UART0_RX/I2C_SCL/SPIO_CSN/GP1) A1.20(I2C1_SCL/SPI1_TX/GP15) ; also sheet 3
M2_PWM_H: A1.26(GP20/I2C0_SDA) ; also sheet 3
M2_PWM_L: A1.27(GP21/I2C0_SCL) ; also sheet 3
MISO: A1.12(UART1_RX/I2C0_SCL/SPI1_CSN/GP9) ; also sheet 4
MOSI: A1.14(I2CS1_SDA/SPI1_SCK/GP10) ; also sheet 4
PLAYER1: A1.4(I2C1_SDA/SPI0_SCK/GP2) ; also sheet 4
PLAYER2: A1.5(I2C1_SCL/SPI0_TX/GP3) ; also sheet 4
PLAYER3: A1.6(UART1_TX/I2C0_SDA/SPI0_RX/GP4) ; also sheet 4
PLAYER4: A1.7(UART1_RX/I2C0_SCL/SPI0_CSN/GP5) ; also sheet 4
PWM_CHARGE: A1.25(GP19/SPI0_TX/I2C1_SCL) ; also sheet 6
PWM_KICK: A1.24(GP18/SPI0_SCK/I2C1_SDA) ; also sheet 6
R_CE: A1.9(I2C1_SDA/SPIO_SCK/GP6) ; also sheet 4
RESET: A1.30(RUN) ; also sheet 5
SCLK: A1.11(UART1_TX/I2C0_SDA/SPI1_RX/GP8) ; also sheet 4
SHOOT_BUTTOM: A1.29(GP22) ; also sheet 5
SS: A1.10(I2C1_SCL/SPIO_TX/GP7) ; also sheet 4
SWCLK: A1.D1(SWCLK)
SWDIO: A1.D3(SWDIO)
V_BAT_VALUE: A1.15(I2C1_SCL/SPI1_TX/GP11) ; also sheet 4
V_CAP_VALUE: A1.16(UART0_TX/I2C0_SDA/SPI1_RX/GP12) ; also sheet 6
Unconnected: A1.32(GP27/ADC1/I2C1_SCL) A1.34(GP28/ADC2) A1.35(ADC_VREF) A1.36(3V3(OUT)) A1.37(3V3_EN) A1.40(VBUS)

## Library data of the parts
A1 = WarthogRobotics-Modules:RASPBERRY_PI_PICO_PTH
BUZZER = rcl:R-US_: RESISTOR, American symbol; SPICEPREFIX: R
C1-C16 C22 = WarthogRobotics-RLC:C
C6.1 C6.30 C6.31 = rcl:C-EU: CAPACITOR, European symbol
CON1 CON2 CON4 CON5 = WarthogRobotics-Connectors:MICROFIT_HEADER-2X01-90°-BACKUP: Molex Micro-Fit 3.0 - Header Shrouded, Thru hole, Right Angle; P/N: SD-43045-0200, SD-43045-0201, SD-43045-0202 http://www.molex.com/pdm_docs/sd/430450200_sd.pdf
CON3 = WarthogRobotics-Connectors:PIN_HEADER_MALE-1X06
CON6 = WarthogRobotics-Connectors:DS01C-254-L-04BE: Check availability <https://pricing.snapeda.com/parts/DS01C-254-L-04BE/CUI%20Devices/view-part?ref=eda>; AVAILABILITY: In Stock; CHECK_PRICES: https://www.snapeda.com/parts/DS01C-254-L-04BE/CUI+Devices/view-part/?ref=eda; CUI_PURCHASE_URL: https://www.cuidevices.com/product/switches/dip-switches/ds01c-254-l-04be?utm_source=snapeda.com&utm_medium=referral&utm_campaign=snapedaBOM; DESCRIPTION: 4 Position, Through Hole, 2.54 mm Pitch, Raised Slide Actuator, Convex Bottom, Long Pin, DIP Switch; MF: CUI Devices; MP: DS01C-254-L-04BE; PACKAGE: None; PRICE: None; SNAPEDA_LINK: https://www.snapeda.com/parts/DS01C-254-L-04BE/CUI+Devices/view-part/?ref=snap
CPOL1 CPOL2 CPOL6-CPOL9 = WarthogRobotics-RLC:CPOL
D0 D1-D11 = WarthogRobotics-Diodes:1N5406: SCHOTTKY DIODE
D13 = Auriga_lib:DIODE_SCHOTTIK
EMISSOR RECEPTOR = EP_molex_6410_7395 (1):22-?-02: CONNECTOR wire to board 2.54 mm (.1 inch) pitch header
HL1-HL3 = WarthogRobotics-Holes:MOUNT-PAD-ROUND: MOUNTING PAD, round
J1-J4 = Library:PIN_HEADE_1: Check availability <https://pricing.snapeda.com/parts/MTMM-101-04-L-S-160/Samtec/view-part?ref=eda>
L2 = Auriga_lib:INDUCTOR
LED1-LED6 = WarthogRobotics-LED:LED
OC1 OC2 = optocoupler:PC817: SHARP OPTO COUPLER
Q1 = Auriga_lib:IRF9540
Q2 = WarthogRobotics-Transistors:2N7002,215; COPYRIGHT: Copyright (C) 2016 Accelerated Designs. All rights reserved; MANUFACTURER_PART_NUMBER: 2N7002,215; SOURCELIBRARY: Nexperia_2018-05-2018; VENDOR: Nexperia
R1.3 R1.4 = rcl-2:R-EU_: RESISTOR, European symbol
R2-R4 R4.8 R4.9 R5 R6 R6.1-R6.8 R6.12 R7 R8 R8.1-R8.6 R8.26 R8.27 R8.30 R8.32 R9 R11-R14 = WarthogRobotics-RLC:R
RADIO0 = pinhead:PINHD-2X4: PIN HEADER
SH1 SH3 = BUCK_LM2576:PUSH_BUTTOM
U1 U2 U5 = st-microelectronics:L298: DUAL FULL-BRIDGE DRIVER; MPN: L298N; OC_FARNELL: 1589425; OC_NEWARK: 32M1527
U3 = WarthogRobotics-IC-Power:LM2576: Step-Down Voltage Regulator
U4 = WarthogRobotics-IC-Power:REG1117
U6 = WarthogRobotics-IC-Special_Function:CD4066B: CMOS QUAD BILATERAL SWITCH

## Net classes
0 Signal: width 0.457 mm, clearance 0.356 mm
1 Power: width 0.61 mm, clearance 0.406 mm